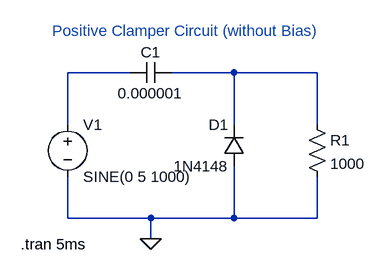
[diagram p0: schematic Assignment 2a (i).asc]
Assignment 2a (i).asc, the LTspice schematic file:
Version 4.1
SHEET 1 880 680
WIRE 176 48 80 48
WIRE 336 48 240 48
WIRE 464 48 336 48
WIRE 80 128 80 48
WIRE 336 128 336 48
WIRE 464 128 464 48
WIRE 80 272 80 208
WIRE 208 272 80 272
WIRE 336 272 336 192
WIRE 336 272 208 272
WIRE 464 272 464 208
WIRE 464 272 336 272
WIRE 208 304 208 272
FLAG 208 304 0
SYMBOL voltage 80 112 R0
WINDOW 123 0 0 Left 0
WINDOW 39 0 0 Left 0
SYMATTR InstName V1
SYMATTR Value SINE(0 5 1000)
SYMBOL cap 240 32 R90
WINDOW 0 0 32 VBottom 2
WINDOW 3 32 32 VTop 2
SYMATTR InstName C1
SYMATTR Value 0.000001
SYMBOL res 448 112 R0
SYMATTR InstName R1
SYMATTR Value 1000
SYMBOL diode 352 192 R180
WINDOW 0 24 64 Left 2
WINDOW 3 24 0 Left 2
SYMATTR InstName D1
SYMATTR Value 1N4148
TEXT 8 312 Left 2 !.tran 5ms
TEXT 56 -16 Left 2 ;Positive Clamper Circuit (without Bias)

The netlist it stands for:
* Assignment 2a (i).asc
V1 N001 0 SINE(0 5 1000)
C1 N002 N001 0.000001
R1 N002 0 1000
D1 0 N002 1N4148
.model D D
.lib standard.dio
.tran 5ms
* Positive Clamper Circuit (without Bias)
.backanno
.end